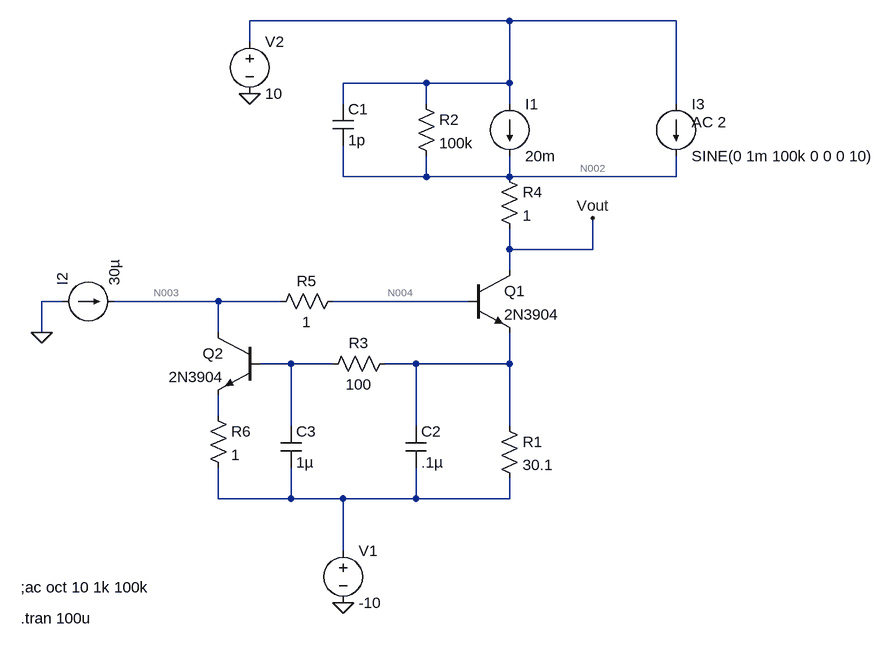
[diagram p0: schematic vas_with_protection.asc]
vas_with_protection.asc, the LTspice schematic file:
Version 4
SHEET 1 916 680
WIRE 320 -272 -80 -272
WIRE 576 -272 320 -272
WIRE -80 -240 -80 -272
WIRE 192 -176 64 -176
WIRE 320 -176 320 -272
WIRE 320 -176 192 -176
WIRE 64 -144 64 -176
WIRE 192 -144 192 -176
WIRE 320 -144 320 -176
WIRE 576 -144 576 -272
WIRE 64 -32 64 -80
WIRE 192 -32 192 -64
WIRE 192 -32 64 -32
WIRE 320 -32 320 -64
WIRE 320 -32 192 -32
WIRE 576 -32 576 -64
WIRE 576 -32 320 -32
WIRE 320 80 320 48
WIRE 448 80 448 32
WIRE 448 80 320 80
WIRE 320 112 320 80
WIRE -368 160 -400 160
WIRE -128 160 -288 160
WIRE -32 160 -128 160
WIRE 256 160 48 160
WIRE -400 208 -400 160
WIRE -128 208 -128 160
WIRE -16 256 -64 256
WIRE 48 256 -16 256
WIRE 176 256 128 256
WIRE 320 256 320 208
WIRE 320 256 176 256
WIRE -128 336 -128 304
WIRE -16 352 -16 256
WIRE 176 352 176 256
WIRE 320 352 320 256
WIRE -128 464 -128 416
WIRE -16 464 -16 416
WIRE -16 464 -128 464
WIRE 64 464 -16 464
WIRE 176 464 176 416
WIRE 176 464 64 464
WIRE 320 464 320 432
WIRE 320 464 176 464
WIRE 64 544 64 464
FLAG 64 624 0
FLAG -400 208 0
FLAG -80 -160 0
FLAG 448 32 Vout
SYMBOL res 304 336 R0
SYMATTR InstName R1
SYMATTR Value 30.1
SYMBOL npn 256 112 R0
SYMATTR InstName Q1
SYMATTR Value 2N3904
SYMBOL current 320 -144 R0
WINDOW 123 0 0 Left 0
WINDOW 39 0 0 Left 0
SYMATTR InstName I1
SYMATTR Value 20m
SYMBOL res 176 -160 R0
SYMATTR InstName R2
SYMATTR Value 100k
SYMBOL cap 48 -144 R0
SYMATTR InstName C1
SYMATTR Value 1p
SYMBOL cap 160 352 R0
SYMATTR InstName C2
SYMATTR Value .1µ
SYMBOL res 32 272 R270
WINDOW 0 32 56 VTop 0
WINDOW 3 0 56 VBottom 0
SYMATTR InstName R3
SYMATTR Value 100
SYMBOL cap -32 352 R0
SYMATTR InstName C3
SYMATTR Value 1µ
SYMBOL voltage 64 528 R0
WINDOW 123 0 0 Left 0
WINDOW 39 0 0 Left 0
SYMATTR InstName V1
SYMATTR Value -10
SYMBOL voltage -80 -256 R0
WINDOW 123 0 0 Left 0
WINDOW 39 0 0 Left 0
SYMATTR InstName V2
SYMATTR Value 10
SYMBOL res 304 -48 R0
SYMATTR InstName R4
SYMATTR Value 1
SYMBOL res -48 176 R270
WINDOW 0 32 56 VTop 0
WINDOW 3 0 56 VBottom 0
SYMATTR InstName R5
SYMATTR Value 1
SYMBOL res -144 320 R0
SYMATTR InstName R6
SYMATTR Value 1
SYMBOL npn -64 208 M0
SYMATTR InstName Q2
SYMATTR Value 2N3904
SYMBOL current 576 -144 R0
WINDOW 123 24 28 Left 0
WINDOW 39 0 0 Left 0
SYMATTR InstName I3
SYMATTR Value SINE(0 1m 100k 0 0 0 10)
SYMATTR Value2 AC 2
SYMBOL current -368 160 R270
WINDOW 123 0 0 Left 0
WINDOW 39 0 0 Left 0
SYMATTR InstName I2
SYMATTR Value 30µ
TEXT -432 648 Left 0 !.tran 100u
TEXT -432 600 Left 0 !;ac oct 10 1k 100k

The netlist it stands for:
* vas_with_protection.asc
R1 N006 N008 30.1
Q1 Vout N004 N006 0 2N3904
I1 N001 N002 20m
R2 N001 N002 100k
C1 N001 N002 1p
C2 N006 N008 .1µ
R3 N005 N006 100
C3 N005 N008 1µ
V1 N008 0 -10
V2 N001 0 10
R4 N002 Vout 1
R5 N003 N004 1
R6 N007 N008 1
Q2 N003 N005 N007 0 2N3904
I3 N001 N002 SINE(0 1m 100k 0 0 0 10) AC 2
I2 0 N003 30µ
.model NPN NPN
.model PNP PNP
.lib standard.bjt
.tran 100u
;ac oct 10 1k 100k
.backanno
.end

* Results of the author's LTspice run, read from the files saved beside the schematic
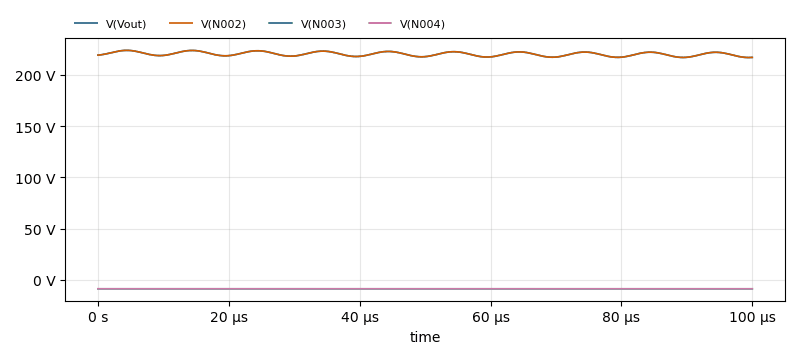
[diagram p1: Transient Analysis of vas_with_protection.asc, plotted from the saved traces]
* Transient Analysis, 1 run:
*   V(Vout): min 216.9 V, max 223.9 V, average 220.3 V, rms 220.3 V, last 217 V
*   V(N002): min 216.9 V, max 223.9 V, average 220.3 V, rms 220.3 V, last 217 V
*   V(N003): min -8.773 V, max -8.744 V, average -8.759 V, rms 8.759 V, last -8.769 V
*   V(N004): min -8.773 V, max -8.744 V, average -8.759 V, rms 8.759 V, last -8.769 V